# Altium schematic sheet CH32M030G8R7_1V1.SchDoc
size C; SheetNumber: 2; SheetTotal: 2
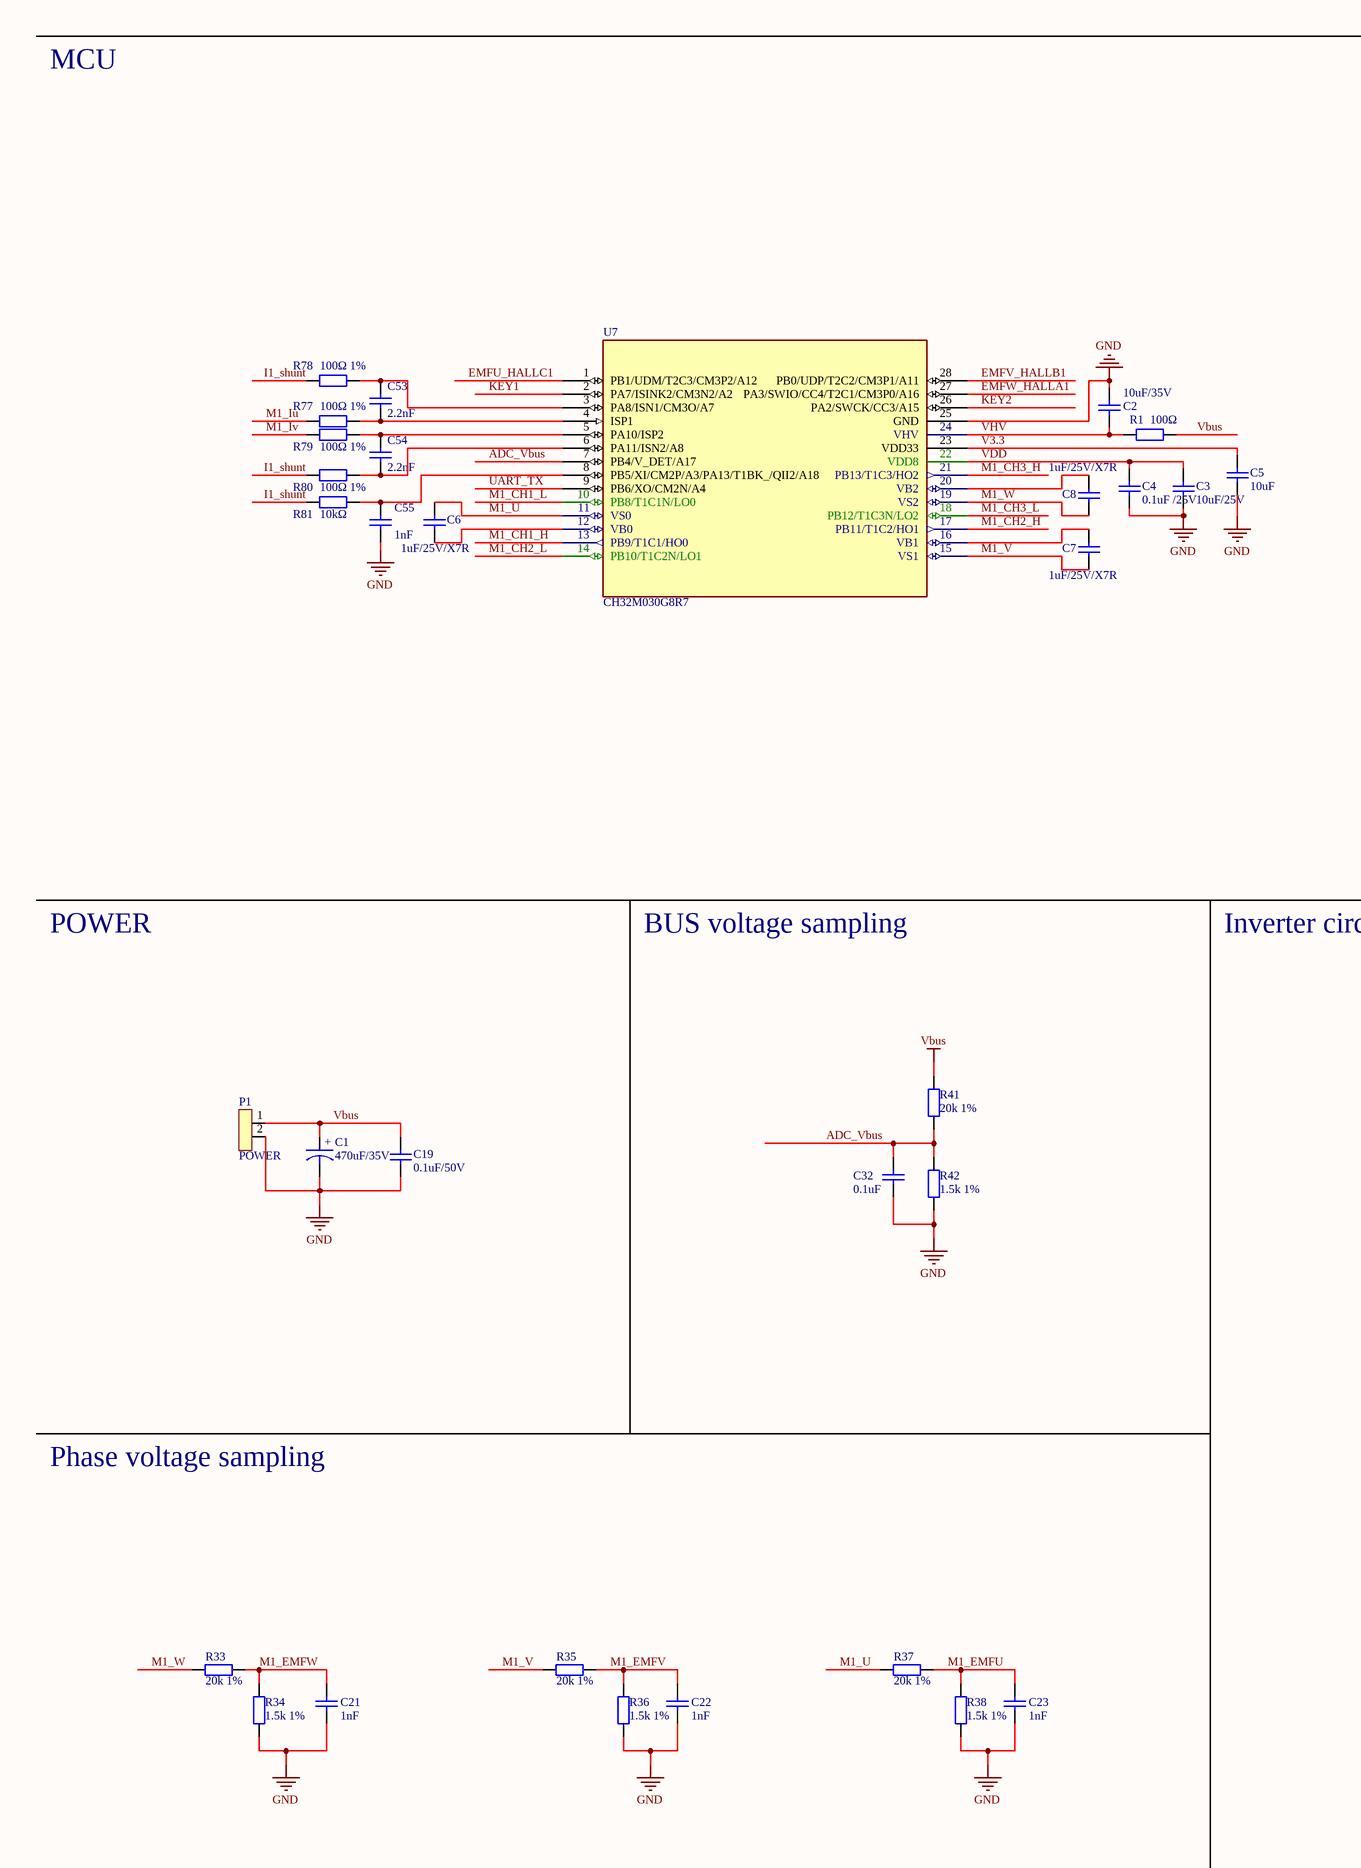
[diagram p0: CH32M030G8R7_1V1.SchDoc, left]
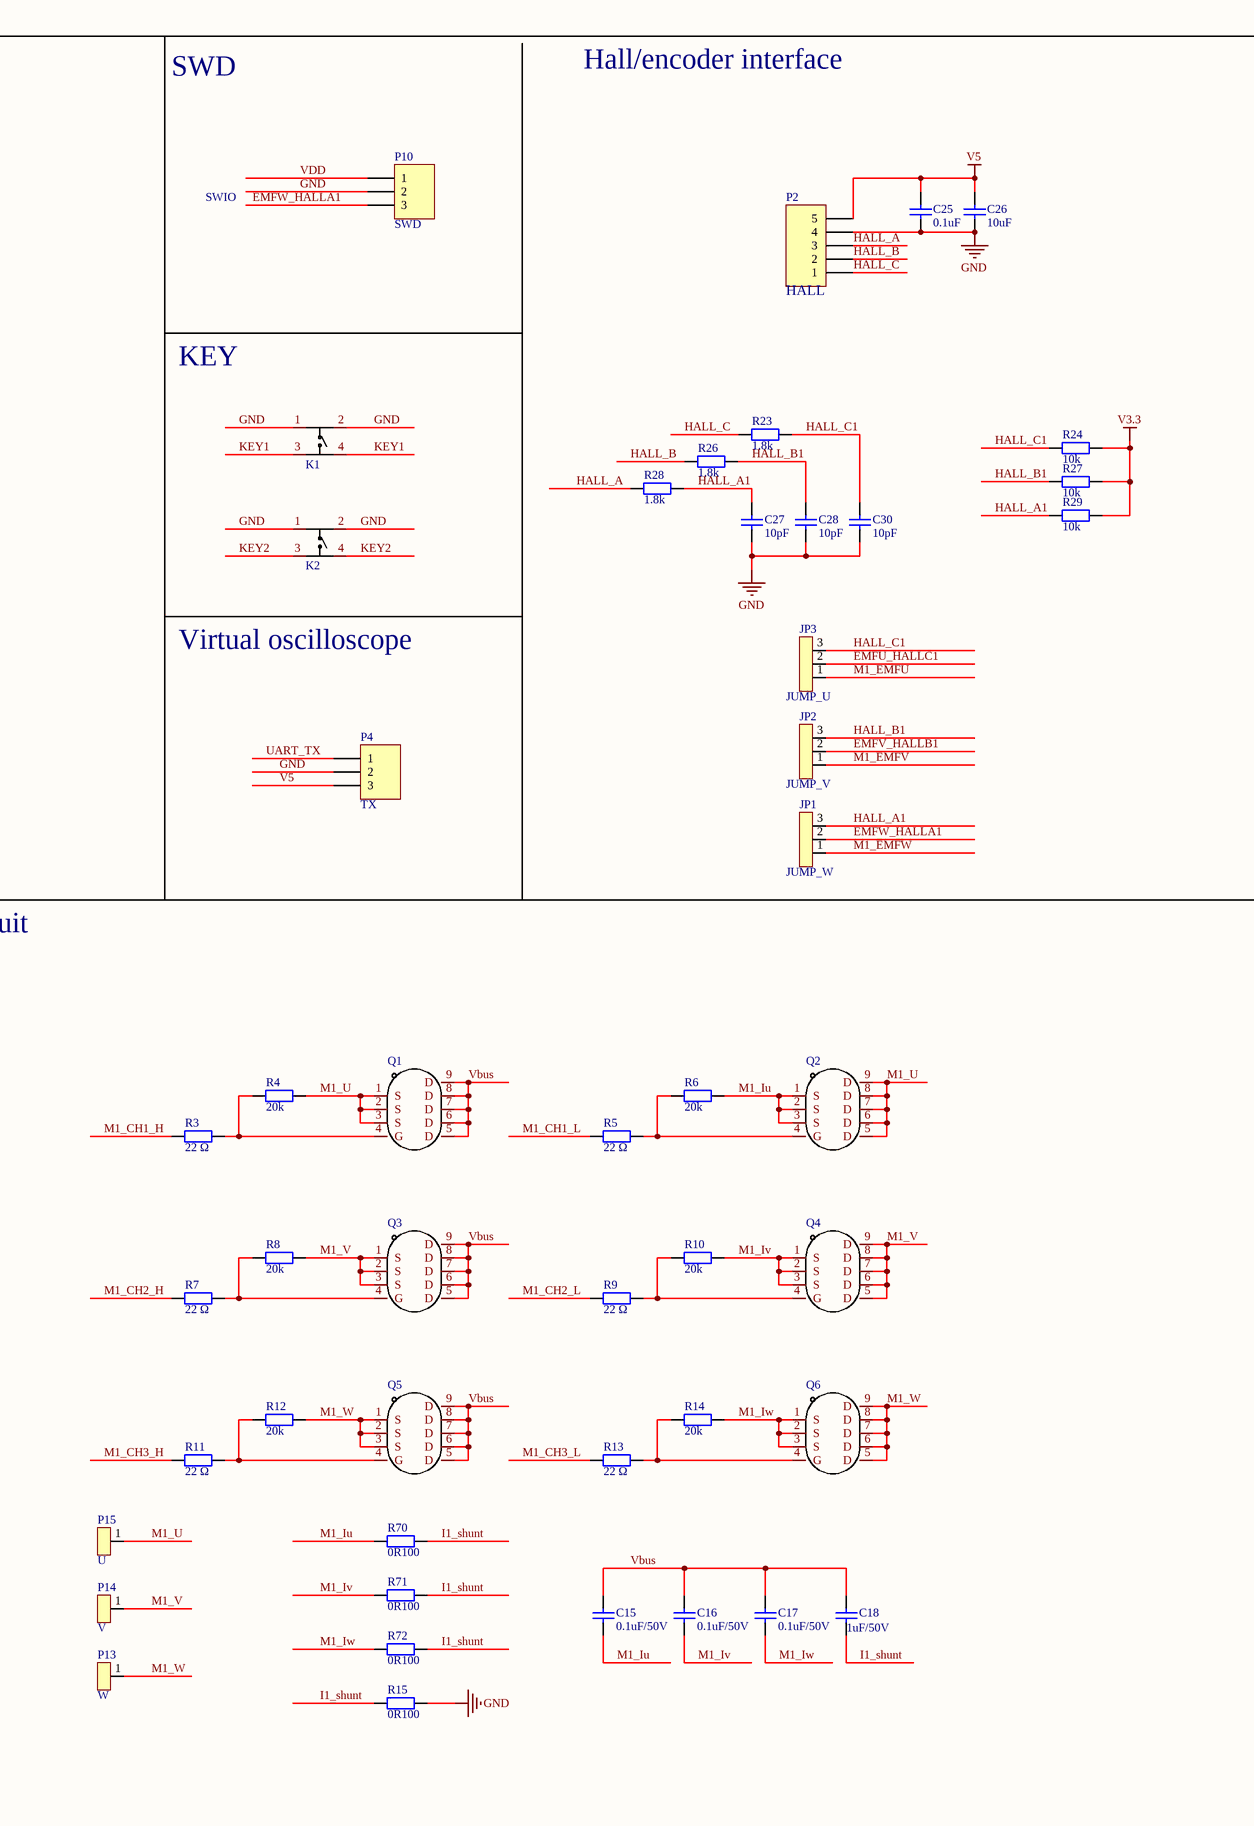
[diagram p1: CH32M030G8R7_1V1.SchDoc, right]

## Parts
C1  470uF/35V  [M_C_RB_D10F5]
C2  10uF/35V  [M_C0805-]
C3  10uF/25V  [M_C0805-]
C4  0.1uF /25V  [M_C0402-]
C5  10uF  [M_C0603]
C6  1uF/25V/X7R  [M_C0805]
C7  1uF/25V/X7R  [M_C0805]
C8  1uF/25V/X7R  [M_C0805]
C15  0.1uF/50V  [M_C0402-]
C16  0.1uF/50V  [M_C0402-]
C17  0.1uF/50V  [M_C0402-]
C18  1uF/50V  [M_C0805-]
C19  0.1uF/50V  [M_C0402-]
C21  1nF  [M_C0402-]
C22  1nF  [M_C0402-]
C23  1nF  [M_C0402-]
C25  0.1uF  [0603]
C26  10uF  [0603]
C27  10pF  [0603]
C28  10pF  [0603]
C30  10pF  [0603]
C32  0.1uF  [M_C0402-]
C53  2.2nF  [M_C0402-]
C54  2.2nF  [M_C0402-]
C55  1nF  [M_C0402-]
JP1  JUMP_W  [HDR2.54-LI-3P]
JP2  JUMP_V  [HDR2.54-LI-3P]
JP3  JUMP_U  [HDR2.54-LI-3P]
K1  KH-6X6X8H-STM  [KEY2-SMD]  (value not drawn)
K2  KH-6X6X8H-STM  [KEY2-SMD]  (value not drawn)
P1  POWER  [WJ15EDGRC3.81-2]
P2  Header 5  [2510-5]  (value not drawn)
P4  TX  [HDR2.54-LI-3P]
P10  SWD  [HDR2.54-LI-3P]
P13  W  [M_PAD-2.4/3.7]
P14  V  [M_PAD-2.4/3.7]
P15  U  [M_PAD-2.4/3.7]
Q1  NP160S04PD6  [M_PDFN-8_L5.8-W4.9]  (value not drawn)
Q2  NP160S04PD6  [M_PDFN-8_L5.8-W4.9]  (value not drawn)
Q3  NP160S04PD6  [M_PDFN-8_L5.8-W4.9]  (value not drawn)
Q4  NP160S04PD6  [M_PDFN-8_L5.8-W4.9]  (value not drawn)
Q5  NP160S04PD6  [M_PDFN-8_L5.8-W4.9]  (value not drawn)
Q6  NP160S04PD6  [M_PDFN-8_L5.8-W4.9]  (value not drawn)
R1  100Ω  [M_R1206-]
R3  22 Ω  [M_R0402-]
R4  20k  [M_R0402-]
R5  22 Ω  [M_R0402-]
R6  20k  [M_R0402-]
R7  22 Ω  [M_R0402-]
R8  20k  [M_R0402-]
R9  22 Ω  [M_R0402-]
R10  20k  [M_R0402-]
R11  22 Ω  [M_R0402-]
R12  20k  [M_R0402-]
R13  22 Ω  [M_R0402-]
R14  20k  [M_R0402-]
R15  0R100  [M_R2512]
R23  1.8k  [0603]
R24  10k  [M_R0402-]
R26  1.8k  [0603]
R27  10k  [M_R0402-]
R28  1.8k  [0603]
R29  10k  [M_R0402-]
R33  20k 1%  [M_R0603]
R34  1.5k 1%  [M_R0402-]
R35  20k 1%  [M_R0603]
R36  1.5k 1%  [M_R0402-]
R37  20k 1%  [M_R0603]
R38  1.5k 1%  [M_R0402-]
R41  20k 1%  [M_R0603]
R42  1.5k 1%  [M_R0402-]
R70  0R100  [M_R2512]
R71  0R100  [M_R2512]
R72  0R100  [M_R2512]
R77  100Ω 1%  [M_R0402-]
R78  100Ω 1%  [M_R0402-]
R79  100Ω 1%  [M_R0402-]
R80  100Ω 1%  [M_R0402-]
R81  10kΩ  [M_R0402-]
U7  CH32M030G8R7  [QSOP28]

## Nets
GND: C1.2 C2.1 C3.1 C4.2 C5.1 C19.2 C21.2 C22.2 C23.2 C25.2 C26.2 C27.2 C28.2 C30.2 C32.2 C55.2 K1.1(A) K1.2(B) K2.1(A) K2.2(B) P1.2 P2.4 P4.2 P10.2 R15.1 R34.1 R36.1 R38.1 R42.1 U7.25(GND)
V3.3: C5.2 R24.1 R27.1 R29.1 U7.23(VDD33)
V5: C25.1 C26.1 P2.5 P4.3
Vbus: C1.1 C15.1 C16.1 C17.1 C18.1 C19.1 P1.1 Q1.5(D) Q1.6(D) Q1.7(D) Q1.8(D) Q1.9(D) Q3.5(D) Q3.6(D) Q3.7(D) Q3.8(D) Q3.9(D) Q5.5(D) Q5.6(D) Q5.7(D) Q5.8(D) Q5.9(D) R1.1 R41.2
ADC_Vbus: C32.1 R41.1 R42.2 U7.7(PB4/V_DET/A17)
EMFU_HALLC1: JP3.2 U7.1(PB1/UDM/T2C3/CM3P2/A12)
EMFV_HALLB1: JP2.2 U7.28(PB0/UDP/T2C2/CM3P1/A11)
EMFW_HALLA1: JP1.2 P10.3 U7.27(PA3/SWIO/CC4/T2C1/CM3P0/A16)
HALL_A: P2.3 R28.1
HALL_A1: C27.1 JP1.3 R28.2 R29.2
HALL_B: P2.2 R26.1
HALL_B1: C28.1 JP2.3 R26.2 R27.2
HALL_C: P2.1 R23.1
HALL_C1: C30.1 JP3.3 R23.2 R24.2
I1_shunt: C18.2 R15.2 R70.1 R71.1 R72.1 R78.1 R80.1 R81.1
KEY1: K1.3(C) K1.4(D) U7.2(PA7/ISINK2/CM3N2/A2)
KEY2: K2.3(C) K2.4(D) U7.26(PA2/SWCK/CC3/A15)
M1_CH1_H: R3.2 U7.13(PB9/T1C1/HO0)
M1_CH1_L: R5.2 U7.10(PB8/T1C1N/LO0)
M1_CH2_H: R7.2 U7.17(PB11/T1C2/HO1)
M1_CH2_L: R9.2 U7.14(PB10/T1C2N/LO1)
M1_CH3_H: R11.2 U7.21(PB13/T1C3/HO2)
M1_CH3_L: R13.2 U7.18(PB12/T1C3N/LO2)
M1_EMFU: C23.1 JP3.1 R37.1 R38.2
M1_EMFV: C22.1 JP2.1 R35.1 R36.2
M1_EMFW: C21.1 JP1.1 R33.1 R34.2
M1_Iu: C15.2 Q2.1(S) Q2.2(S) Q2.3(S) R6.1 R70.2 R77.1
M1_Iv: C16.2 Q4.1(S) Q4.2(S) Q4.3(S) R10.1 R71.2 R79.1
M1_Iw: C17.2 Q6.1(S) Q6.2(S) Q6.3(S) R14.1 R72.2
M1_U: C6.2 P15.1 Q1.1(S) Q1.2(S) Q1.3(S) Q2.5(D) Q2.6(D) Q2.7(D) Q2.8(D) Q2.9(D) R4.1 R37.2 U7.11(VS0)
M1_V: C7.2 P14.1 Q3.1(S) Q3.2(S) Q3.3(S) Q4.5(D) Q4.6(D) Q4.7(D) Q4.8(D) Q4.9(D) R8.1 R35.2 U7.15(VS1)
M1_W: C8.2 P13.1 Q5.1(S) Q5.2(S) Q5.3(S) Q6.5(D) Q6.6(D) Q6.7(D) Q6.8(D) Q6.9(D) R12.1 R33.2 U7.19(VS2)
UART_TX: P4.1 U7.9(PB6/XO/CM2N/A4)
VDD: C3.2 C4.1 P10.1 U7.22(VDD8)
VHV: C2.2 R1.2 U7.24(VHV)
NetC6_1: C6.1 U7.12(VB0)
NetC7_1: C7.1 U7.16(VB1)
NetC8_1: C8.1 U7.20(VB2)
NetC53_1: C53.1 R78.2 U7.3(PA8/ISN1/CM3O/A7)
NetC53_2: C53.2 R77.2 U7.4(ISP1)
NetC54_1: C54.1 R79.2 U7.5(PA10/ISP2)
NetC54_2: C54.2 R80.2 U7.6(PA11/ISN2/A8)
NetC55_1: C55.1 R81.2 U7.8(PB5/XI/CM2P/A3/PA13/T1BK_/QII2/A18)
NetQ1_4: Q1.4(G) R3.1 R4.2
NetQ2_4: Q2.4(G) R5.1 R6.2
NetQ3_4: Q3.4(G) R7.1 R8.2
NetQ4_4: Q4.4(G) R9.1 R10.2
NetQ5_4: Q5.4(G) R11.1 R12.2
NetQ6_4: Q6.4(G) R13.1 R14.2

## Notes on the sheet
- MCU
- SWD
- Hall/encoder interface
- SWIO
- (near P2) HALL
- KEY
- Virtual oscilloscope
- POWER
- BUS voltage sampling
- Inverter circuit
- Phase voltage sampling
- (in symbol CAPACITOR POL_2) +

## Library data of the parts
C1 = CAPACITOR POL_2: Capacitor; Value: 470uF/35V
C2-C8 C15-C19 C21-C23 C25-C28 C30 C32 C53-C55 = Cap Semi: Capacitor (Semiconductor SIM Model); Published: 8-Jun-2000; LatestRevisionDate: 17-Jul-2002; LatestRevisionNote: Re-released for DXP Platform.; PackageReference: C0805; Publisher: Altium Limited
  C2: Value: 10uF/35V
  C3: Value: 10uF/25V
  C4: Value: 0.1uF /25V
  C5 C26: Value: 10uF
  C6-C8: Value: 1uF/25V/X7R
  C15-C17 C19: Value: 0.1uF/50V
  C18: Value: 1uF/50V
  C21-C23 C55: Value: 1nF
  C25 C32: Value: 0.1uF
  C27 C28 C30: Value: 10pF
  C53 C54: Value: 2.2nF
JP1-JP3 = 3PIN
K1 K2 = KH-6X6X8H-STM: Add into BOM: yes; Contact Current: 50mA; Voltage Rating (DC): 12V; Mechanical Life: 80000; Switch Length: 6mm; Name: KH-6X6X8H-STM; Symbol: KH-6X6X8H-STM; Device: KH-6X6X8H-STM; LCSC Part Name: KH-6X6X8H-STM; Supplier Part: C2837534; Manufacturer Part: KH-6X6X8H-STM; Supplier Footprint: SMD; JLCPCB Part Class: Extended Part; Datasheet: https://atta.szlcsc.com/upload/public/pdf/source/20210608/C2837534_94EAC7D8AFBB996E2814FACF50FEEF85.pdf; Supplier: LCSC; Convert to PCB: yes; Voltage Rating (AC): -; Power Rating: -; With Lamp: -; Operating Force: -; Operating Temperature: -; IP Rating: -; Switch Width: 6mm; Switch Height: -
P1 = 2PIN
P2 = Header 5: Header, 5-Pin; LatestRevisionDate: 17-Jul-2002; LatestRevisionNote: Re-released for DXP Platform.; Publisher: Altium Limited
P4 P10 = HEADER 3: Header, 3-Pin
P13-P15 = 1PIN: CONNECTOR
Q1-Q6 = NP100N03D6: Add into BOM: yes; Symbol: NP100N03D6; Device: NP100N03D6; LCSC Part Name: NP100N03D6; Supplier Part: C2991148; Manufacturer Part: NP100N03D6; Supplier Footprint: PDFN-8(5x5.8); JLCPCB Part Class: Extended Part; Datasheet: https://atta.szlcsc.com/upload/public/pdf/source/20220426/E6C9656FCA27A34FA1A0E072B57224E0.pdf; Supplier: LCSC; Convert to PCB: yes
R1 R3-R15 R23 R24 R26-R29 R33-R38 R41 R42 R70-R72 R77-R81 = Res2: Resistor; Published: 8-Jun-2000; LatestRevisionDate: 17-Jul-2002; LatestRevisionNote: Re-released for DXP Platform.; PackageReference: AXIAL-0.4; Publisher: Altium Limited
  R1: Value: 100Ω
  R3 R5 R7 R9 R11 R13: Value: 22 Ω
  R4 R6 R8 R10 R12 R14: Value: 20k
  R15 R70-R72: Value: 0R100
  R23 R26 R28: Value: 1.8k
  R24 R27 R29: Value: 10k
  R33 R35 R37 R41: Value: 20k 1%
  R34 R36 R38 R42: Value: 1.5k 1%
  R77-R80: Value: 100Ω 1%
  R81: Value: 10kΩ
U7 = CH32M030G8R7: RISC-V MCU, 72MHz, USB, Type-C/PD, OPA, CMP, 28V gate driver